# Altium schematic sheet STlink_V3E_PWR.SchDoc: ST-LINK/V3E-SWD Power Module
size A4; Date: Not used; ApprovedBy: Not used; CheckedBy: Not used; Author: Not used; CompanyName: STMicroelectronics; DrawnBy: Not used; Engineer: Not used; Organization: Not used; Address1: Not used; Address2: Not used; Address3: Not used; Address4: Not used; DocumentNumber: Not used; Revision: Not used; SheetNumber: 18; SheetTotal: 19; CurrentTime: Not used; CurrentDate: Not used; Time: Not used; DocumentFullPathAndName: Not used; DocumentName: Not used; ModifiedDate: Not used; ImagePath: Not used; ProjectName: Not used; Application_BuildNumber: Not used
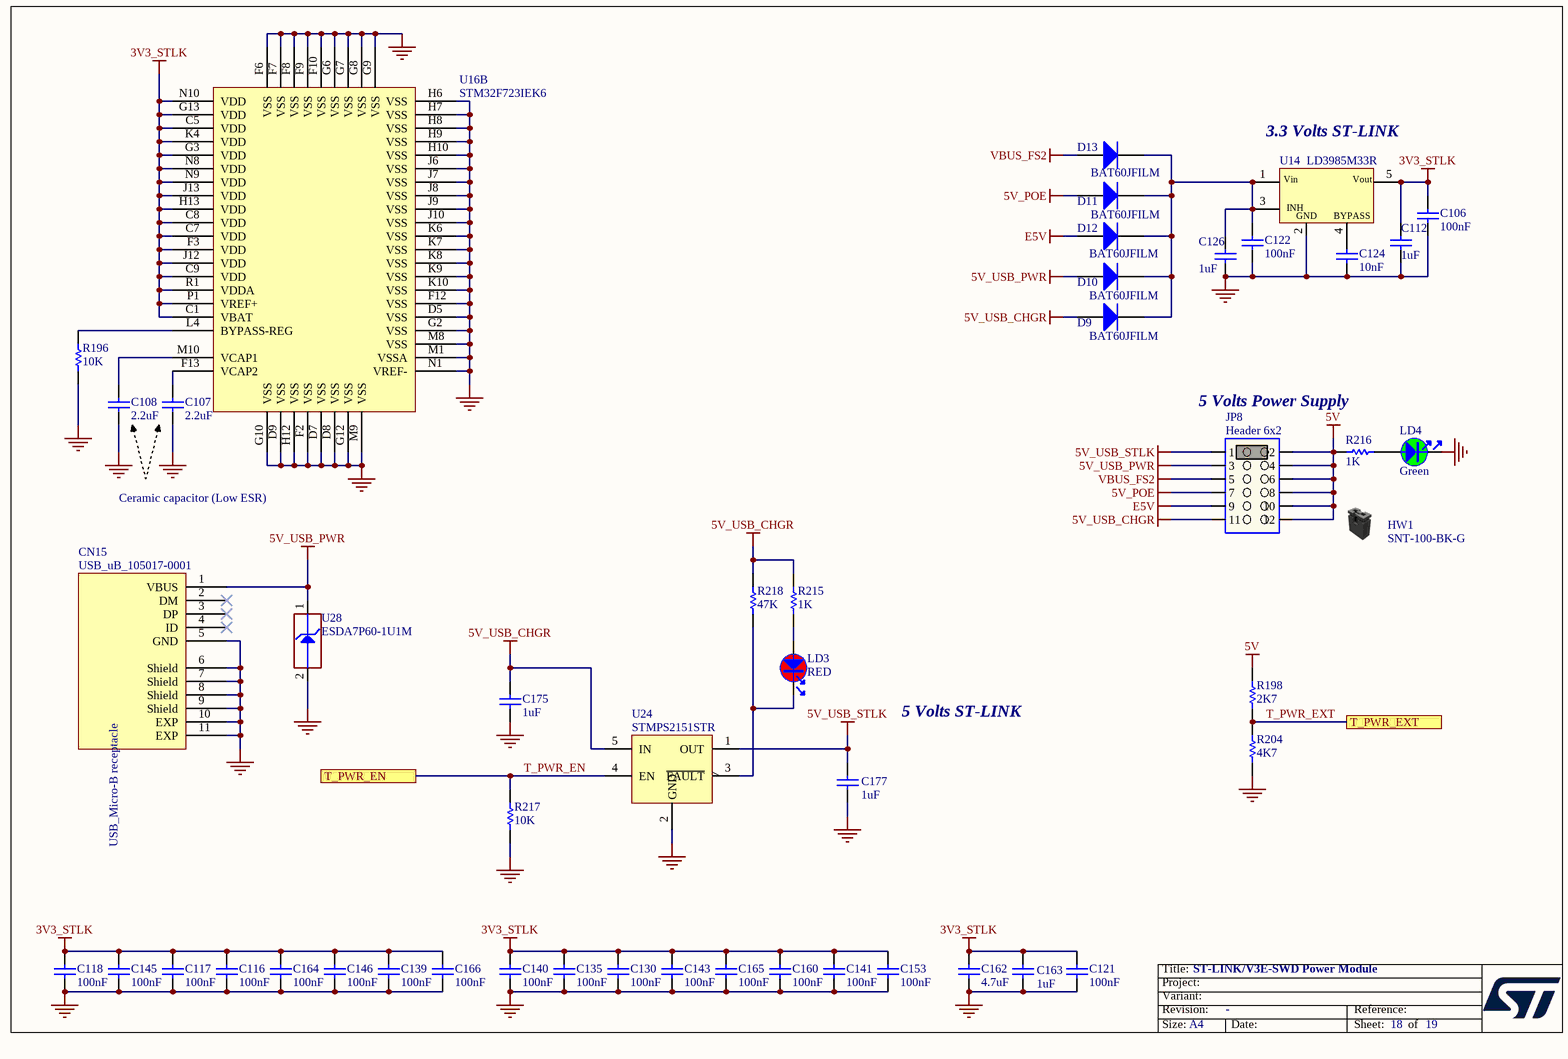
[diagram p0: STlink_V3E_PWR.SchDoc]

## Parts
C106  value 100nF  [C0402]  (hidden comment: Capacitor)
C107  value 2.2uF  [C1206_H1P15]  (hidden comment: Capacitor)
C108  value 2.2uF  [C1206_H1P15]  (hidden comment: Capacitor)
C112  value 1uF  [C0603]  (hidden comment: Capacitor)
C116  value 100nF  [C0402]  (hidden comment: Capacitor)
C117  value 100nF  [C0402]  (hidden comment: Capacitor)
C118  value 100nF  [C0402]  (hidden comment: Capacitor)
C121  value 100nF  [C0402]  (hidden comment: Capacitor)
C122  value 100nF  [C0402]  (hidden comment: Capacitor)
C124  value 10nF  [C0402]  (hidden comment: Capacitor)
C126  value 1uF  [C0603]  (hidden comment: Capacitor)
C130  value 100nF  [C0402]  (hidden comment: Capacitor)
C135  value 100nF  [C0402]  (hidden comment: Capacitor)
C139  value 100nF  [C0402]  (hidden comment: Capacitor)
C140  value 100nF  [C0402]  (hidden comment: Capacitor)
C141  value 100nF  [C0402]  (hidden comment: Capacitor)
C143  value 100nF  [C0402]  (hidden comment: Capacitor)
C145  value 100nF  [C0402]  (hidden comment: Capacitor)
C146  value 100nF  [C0402]  (hidden comment: Capacitor)
C153  value 100nF  [C0402]  (hidden comment: Capacitor)
C160  value 100nF  [C0402]  (hidden comment: Capacitor)
C162  value 4.7uF  [C0603]  (hidden comment: Capacitor)
C163  value 1uF  [C0603]  (hidden comment: Capacitor)
C164  value 100nF  [C0402]  (hidden comment: Capacitor)
C165  value 100nF  [C0402]  (hidden comment: Capacitor)
C166  value 100nF  [C0402]  (hidden comment: Capacitor)
C175  value 1uF  [C0603]  (hidden comment: Capacitor)
C177  value 1uF  [C0603]  (hidden comment: Capacitor)
CN15  value USB_uB_105017-0001  [CON_USBMICROB_MOLEX_105017-0001_H2P90]  (hidden comment: USB_uB_105017.0001)
D9  BAT60JFILM  [DIO_SOD323]
D10  BAT60JFILM  [DIO_SOD323]
D11  BAT60JFILM  [DIO_SOD323]
D12  BAT60JFILM  [DIO_SOD323]
D13  BAT60JFILM  [DIO_SOD323]
HW1  value SNT-100-BK-G  (hidden comment: Shunt Black 2.54mm)  (mechanical)
JP8  value Header 6x2  [CON_SAMTEC_TSW-106-07-X-D]  (hidden comment: Shunt Fitted 1-2)
LD3  value RED  [LED_0603_RED]  (hidden comment: LED_red)
LD4  value Green  [LED_0603_GREEN]  (hidden comment: LED_green)
R196  value 10K  [R0402]  (hidden comment: Resistor)
R198  value 2K7  [R0402]  (hidden comment: Resistor)
R204  value 4K7  [R0402]  (hidden comment: Resistor)
R215  value 1K  [R0402]  (hidden comment: Resistor)
R216  value 1K  [R0603]  (hidden comment: Resistor)
R217  value 10K  [R0402]  (hidden comment: Resistor)
R218  value 47K  [R0402]  (hidden comment: Resistor)
U14  LD3985M33R  [REG_SOT23-5L]
U16  value STM32F723IEK6  [ICC_UFBGA201_176+25_10X10_P065]  (hidden comment: ST-LINKV3E_SWD)  (part B of 2)
U24  STMPS2151STR  [MOS_SOT23-5L]
U28  ESDA7P60-1U1M  [ESD_QFN2_1P6X1_P125]

## Ports
T_PWR_EN, T_PWR_EXT

## Nets
3V3_STLK: C106.2 C112.2 C116.2 C117.2 C118.2 C121.2 C130.2 C135.2 C139.2 C140.2 C141.2 C143.2 C145.2 C146.2 C153.2 C160.2 C162.2 C163.2 C164.2 C165.2 C166.2 U14.5(Vout) U16.C1(VBAT) U16.C5(VDD) U16.C7(VDD) U16.C8(VDD) U16.C9(VDD) U16.F3(VDD) U16.G3(VDD) U16.G13(VDD) U16.H13(VDD) U16.J12(VDD) U16.J13(VDD) U16.K4(VDD) U16.N8(VDD) U16.N9(VDD) U16.N10(VDD) U16.P1(VREF+) U16.R1(VDDA)
5V: JP8.2 JP8.4 JP8.6 JP8.8 JP8.10 JP8.12 R198.2 R216.1
5V_POE: D11.1(A) JP8.7
5V_USB_CHGR: C175.2 D9.1(A) JP8.11 R215.2 R218.2 U24.5(IN)
5V_USB_PWR: CN15.1(VBUS) D10.1(A) JP8.3 U28.1(IO1)
5V_USB_STLK: C177.2 JP8.1 U24.1(OUT)
E5V: D12.1(A) JP8.9
GND: C106.1 C107.1 C108.1 C112.1 C116.1 C117.1 C118.1 C121.1 C122.1 C124.1 C126.2 C130.1 C135.1 C139.1 C140.1 C141.1 C143.1 C145.1 C146.1 C153.1 C160.1 C162.1 C163.1 C164.1 C165.1 C166.1 C175.1 C177.1 CN15.5(GND) CN15.6(Shield) CN15.7(Shield) CN15.8(Shield) CN15.9(Shield) CN15.10(EXP) CN15.11(EXP) LD4.2 R196.1 R204.1 R217.2 U14.2(GND) U16.D5(VSS) U16.D7(VSS) U16.D8(VSS) U16.D9(VSS) U16.F2(VSS) U16.F6(VSS) U16.F7(VSS) U16.F8(VSS) U16.F9(VSS) U16.F10(VSS) U16.F12(VSS) U16.G2(VSS) U16.G6(VSS) U16.G7(VSS) U16.G8(VSS) U16.G9(VSS) U16.G10(VSS) U16.G12(VSS) U16.H6(VSS) U16.H7(VSS) U16.H8(VSS) U16.H9(VSS) U16.H10(VSS) U16.H12(VSS) U16.J6(VSS) U16.J7(VSS) U16.J8(VSS) U16.J9(VSS) U16.J10(VSS) U16.K6(VSS) U16.K7(VSS) U16.K8(VSS) U16.K9(VSS) U16.K10(VSS) U16.M1(VSSA) U16.M8(VSS) U16.M9(VSS) U16.N1(VREF-) U24.2(GND) U28.2(GND)
VBUS_FS2: D13.1(A) JP8.5
T_PWR_EN: R217.1 U24.4(EN) ; port T_PWR_EN
T_PWR_EXT: R198.1 R204.2 ; port T_PWR_EXT
NetC107_2: C107.2 U16.F13(VCAP2)
NetC108_2: C108.2 U16.M10(VCAP1)
NetC122_2: C122.2 C126.1 D9.2(K) D10.2(K) D11.2(K) D12.2(K) D13.2(K) U14.1(Vin) U14.3(CE)
NetC124_2: C124.2 U14.4(BYPASS)
NetLD3_1: LD3.1 R215.1
NetLD3_2: LD3.2 R218.1 U24.3(~{FAULT})
NetLD4_1: LD4.1 R216.2
NetR196_2: R196.2 U16.L4(BYPASS-REG)

Not connected (* = marked no-connect by the designer): CN15 2(DM)* 3(DP)* 4(ID)*

## Notes on the sheet
- (near U14) 3.3 Volts ST-LINK
- 5 Volts Power Supply
- Ceramic capacitor (Low ESR)
- 5 Volts ST-LINK
- Title:
- Project:
- Size:
- Revision:
- Variant:
- A4
- -
- Date:
- Reference:
- Sheet:
- of
- (in symbol MCD-00028) USB_Micro-B receptacle
- (in symbol MCD-00086) INH

## Library data of the parts
C106 C116-C118 C121 C122 C130 C135 C139-C141 C143 C145 C146 C153 C160 C164-C166 = MCD-00006: Capacitor, MLCC, 100nF, 16V, X7R, +/-10%, 0402, T=0.5mm; Manufacturer_Part_Number: CC0402KRX7R7BB104; Manufacturer: YAGEO; Part_Preference: Recommended; Partial_Alternate_Internal_Part_Number: MCD-03299; Component_Country_Of_Origin: China; ID: 2474; Order_Code_RS: 9402047; ShowFields: YES; Internal_Part_Number: MCD-00006; Status: Released; Package: 0402; Part_Type: Capacitor; ComponentLink1URL: http://tunmcdsvn.tun.st.com/Component_Documentation_Library/Trunk/Capacitor/YAGEO_X7R_Series; Order_Code_Digikey: 311-1338-1-ND; Order_Code_Farnell: 9402047
C107 C108 = MCD-00008: Capacitor, MLCC, 2.2uF, 16V, X7R, 10%, 1206, T=1,15mm; Manufacturer_Part_Number: CC1206KKX7R7BB225; Manufacturer: YAGEO; Alternate_Manufacturer_Part_Number: C1206C225K4RAC; Alternate_Manufacturer: KEMET; Part_Preference: Recommended; Provided_By: Subcon; Initial_Board_Reference: MB1274; Component_Country_Of_Origin: China; ID: 2472; ShowFields: YES; Internal_Part_Number: MCD-00008; Status: Released; Part_Type: Capacitor; Package: 1206; ComponentLink1Description: Yageo_Capacitor_X7R-series.pdf; ComponentLink1URL: http://tunmcdsvn.tun.st.com/Component_Documentation_Library/Trunk/Capacitor/YAGEO_X7R_Series; ECCN_US: n/a; ECCN_EU: n/a; Order_Code_Digikey: 311-1957-1-ND; Order_Code_Farnell: N/A; Order_Code_RS: N/A
C112 C163 C175 C177 = MCD-00010: Capacitor, MLCC, 1uF, 16V, X5R, 10%, 0603, T=0,8mm; Manufacturer_Part_Number: CC0603KRX5R7BB105; Manufacturer: YAGEO; Part_Preference: Recommended; Provided_By: Subcon; Initial_Board_Reference: mb1274; Component_Country_Of_Origin: China; ID: 2470; Order_Code_RS: 2370680; ShowFields: YES; Internal_Part_Number: MCD-00010; Status: Released; Package: 0603; ComponentLink1Description: Yageo_Capacitor_X5R-series.pdf; ECCN_US: n/a; ECCN_EU: n/a; Part_Type: Capacitor; ComponentLink1URL: http://tunmcdsvn.tun.st.com/Component_Documentation_Library/Trunk/Capacitor/YAGEO_X5R_Series; Order_Code_Digikey: 311-1444-1-ND; Order_Code_Farnell: 2370680
C124 = MCD-00011: Capacitor, MLCC, 10nF, 16V, X7R, 10%, 0402, T=0.5mm; Manufacturer_Part_Number: CC0402KRX7R7BB103; Manufacturer: YAGEO; Part_Preference: Recommended; Provided_By: Subcon; Initial_Board_Reference: mb1274; Component_Country_Of_Origin: China; ID: 2469; Order_Code_RS: 3019275; ShowFields: YES; Internal_Part_Number: MCD-00011; Status: Released; Part_Type: Capacitor; Package: 0402; ComponentLink1Description: Yageo_Capacitor_X7R-series.pdf; ECCN_US: n/a; ECCN_EU: n/a; ComponentLink1URL: http://tunmcdsvn.tun.st.com/Component_Documentation_Library/Trunk/Capacitor/YAGEO_X7R_Series; Order_Code_Digikey: 311-1042-1-ND; Order_Code_Farnell: 3019275
C126 = MCD-00238: Capacitor, MLCC, 1uF, 6V3, X5R, 10%, 0603, T=0,8mm; Manufacturer_Part_Number: CC0603KRX5R5BB105; Manufacturer: YAGEO; Part_Preference: Recommended; Partial_Alternate_Internal_Part_Number: MCD_00010; Provided_By: Subcon; Initial_Board_Reference: mb1319; Component_Country_Of_Origin: China; ID: 2629; ShowFields: YES; Internal_Part_Number: MCD-00238; Status: Released; Part_Type: Capacitor; Package: 0603; ComponentLink1Description: Yageo_Capacitor_X5R-series.pdf; ECCN_US: n/a; ECCN_EU: n/a; ComponentLink1URL: http://tunmcdsvn.tun.st.com/Component_Documentation_Library/Trunk/Capacitor/YAGEO_X5R_Series; Order_Code_Digikey: 311-1447-1-ND; Order_Code_Farnell: N/A; Order_Code_RS: N/A
C162 = MCD-00009: Capacitor, MLCC, 4.7uF, 16V, X5R, 10%, 0603, T=0.8mm; Manufacturer_Part_Number: CC0603KRX5R7BB475; Manufacturer: YAGEO; Part_Preference: Recommended; Partial_Alternate_Internal_Part_Number: MCD-03565; Provided_By: subcon; Initial_Board_Reference: mb1274; Alternate_EMS: A; Component_Country_Of_Origin: China; ID: 2471; ShowFields: YES; Internal_Part_Number: MCD-00009; Status: Released; Part_Type: Capacitor; Package: 0603; ComponentLink1Description: Yageo_Capacitor_X5R-series.pdf; ECCN_US: n/a; ECCN_EU: n/a; ComponentLink1URL: http://tunmcdsvn.tun.st.com/Component_Documentation_Library/Trunk/Capacitor/YAGEO_X5R_Series; Order_Code_Digikey: 311-1785-1-ND; Order_Code_Farnell: N/A; Order_Code_RS: N/A
CN15 = MCD-00028: USB-MICRO-B, 0.65mm, RA, SMT, Bottom Mount,; Manufacturer_Part_Number: 1050170001; Manufacturer: MOLEX; Part_Type: Connector; Part_Preference: Recommended; Provided_By: Subcon; Initial_Board_Reference: mb1274; Component_Country_Of_Origin: Unknown; ID: 2489; Order_Code_RS: 2293836; ShowFields: YES; Internal_Part_Number: MCD-00028; Status: Released; ComponentLink1Description: Molex_Connector-USB-microB_105017-0001.pdf; ECCN_US: n/a; ECCN_EU: n/a; ComponentLink1URL: http://tunmcdsvn.tun.st.com/Component_Documentation_Library/Trunk/Connector/MOLEX_1050170001; Order_Code_Digikey: WM1399TR-ND; Order_Code_Farnell: 2293836
D9-D13 = MCD-00034: Manufacturer: STMICROELECTRONICS; Part_Type: Diode; BMS_Part_Number: 9151097; Manufacturer_HQ_COO: EU; Part_Preference: Recommended; ECCN_US: EAR99; ECCN_EU: NEC; Provided_By: Subcon; Initial_Board_Reference: mb1274; Component_Country_Of_Origin: China; ID: 2483; Order_Code_RS: 714-6879; ShowFields: YES; Internal_Part_Number: MCD-00034; Value: BAT60JFILM; Status: Released; Manufacturer_Part_Number: BAT60JFILM; ComponentLink1Description: STM_Diode_BAT60JFILM-SOD323.pdf; ComponentLink1URL: http://tunmcdsvn.tun.st.com/Component_Documentation_Library/Trunk/Diode/STMICROELECTRONICS_BAT60J_Series; Order_Code_Digikey: 497-3707-2-ND; Order_Code_Farnell: 1467544; Package: SOD323
HW1 = MCD-00043: Shunt, 2.54mm, Black, 4.3A, 6.1mm, 5mR; Manufacturer: SAMTEC; Part_Type: Misc; Full_Alternate_Internal_Part_Number: MCD-02388; Part_Preference: Recommended; Partial_Alternate_Internal_Part_Number: MCD-01849, MCD-01864; Manufacturer_HQ_COO: Unknown; Component_Country_Of_Origin: China, Costa Rica, Malaysia, USA, Vietnam; ID: 2551; Order_Code_RS: 158-7784; ShowFields: YES; Alternate_EMS: A; Internal_Part_Number: MCD-00043; Status: Released; Manufacturer_Part_Number: SNT-100-BK-G; ComponentLink1URL: http://tunmcdsvn.tun.st.com/Component_Documentation_Library/Trunk/Misc/SAMTEC_SNT-100-BK-G; Order_Code_Digikey: SAM8858-ND; Order_Code_Farnell: 2505007; Package: 2.54x5.08mm
JP8 = MCD-00691: Header, 6x2, 2.54mm, VR, TH, T=5.84mm/2.54mm; Part_Type: Connector; Manufacturer_Part_Number: TSW-106-07-G-D; Manufacturer: SAMTEC; Part_Preference: Recommended; Component_Country_Of_Origin: China, Costa Rica, Malaysia, USA, Vietnam; ID: 3060; Order_Code_RS: 161-2505; ShowFields: YES; Internal_Part_Number: MCD-00691; Status: Released; ComponentLink1URL: http://tunmcdsvn.tun.st.com/Component_Documentation_Library/Trunk/Connector/SAMTEC_TSW_Series/; Order_Code_Digikey: SAM1028-06-ND; Order_Code_Farnell: 2984502
LD3 = MCD-02899: LED, Red, VF : Min=1.75V , Max=2.35V, 25mA, 0603; Part_Type: Display; Part_Preference: Recommended; Manufacturer: EVERLIGHT; Manufacturer_Part_Number: 19-213/R6C-AP1Q2B/5T; Full_Alternate_Internal_Part_Number: MCD-00049; Component_Country_Of_Origin: China; ShowFields: YES; ID: 5015; Internal_Part_Number: MCD-02899; Status: Checked; Package: 0603; ComponentLink1URL: http://tunmcdsvn.tun.st.com/Component_Documentation_Library/Trunk/Display/EVERLIGHT_19-213-R6C-AP1Q2B-5T; Order_Code_Digikey: 1080-19-213/R6C-AP1Q2B/5TTR-ND; Order_Code_Farnell: N/A; Order_Code_RS: N/A
LD4 = MCD-02900: LED, Green, 2V, 20mA, 0603; Part_Type: Display; Part_Preference: Recommended; Manufacturer: EVERLIGHT; Manufacturer_Part_Number: 19-213SYGC/S530-E2/5T; Full_Alternate_Internal_Part_Number: MCD-00320; Partial_Alternate_Internal_Part_Number: MCD-00050; Component_Country_Of_Origin: China; ShowFields: YES; ID: 5016; Internal_Part_Number: MCD-02900; Status: Checked; Package: 0603; ComponentLink1URL: http://tunmcdsvn.tun.st.com/Component_Documentation_Library/Trunk/Display/EVERLIGHT_19-213SYGC-S530-E2-5T; Order_Code_Digikey: 1080-19-213SYGC/S530-E2/5TTR-ND; Order_Code_Farnell: N/A; Order_Code_RS: N/A
R196 = MCD-00053: Resistor,10K,0402,1%,1/16W; Manufacturer_Part_Number: RC0402FR-0710KL; Manufacturer: YAGEO; BMS_Part_Number: 9131590; Part_Preference: Recommended; Provided_By: subcon; Initial_Board_Reference: mb1274; Component_Country_Of_Origin: China; ID: 2539; Order_Code_RS: 9239359; ShowFields: YES; Internal_Part_Number: MCD-00053; Status: Released; ComponentLink1Description: Yageo_Resistor_RC0402-series.pdf; ECCN_US: n/a; ECCN_EU: n/a; Part_Type: Resistor; Package: 0402; ComponentLink1URL: http://tunmcdsvn.tun.st.com/Component_Documentation_Library/Trunk/Resistor/YAGEO_RC_L_Series; Order_Code_Digikey: 311-10.0KLRCT-ND; Order_Code_Farnell: 9239359
R198 = MCD-00055: Resistor,2K7,0402,1%,1/16W; Manufacturer_Part_Number: RC0402FR-072K7L; Manufacturer: YAGEO; Part_Preference: Recommended; Provided_By: Subcon; Initial_Board_Reference: mb1274; Component_Country_Of_Origin: China; ID: 2535; Order_Code_RS: 9239286; ShowFields: YES; Internal_Part_Number: MCD-00055; Status: Released; ComponentLink1Description: Yageo_Resistor_RC0402-series.pdf; ECCN_US: n/a; ECCN_EU: n/a; Part_Type: Resistor; Package: 0402; ComponentLink1URL: http://tunmcdsvn.tun.st.com/Component_Documentation_Library/Trunk/Resistor/YAGEO_RC_L_Series; Order_Code_Digikey: 311-2.70KLRCT-ND; Order_Code_Farnell: 9239286
R204 = MCD-00065: Resistor,4K7,0402,1%,1/16W; Manufacturer_Part_Number: RC0402FR-074K7L; Manufacturer: YAGEO; Alternate_Manufacturer_Part_Number: RT0402FRE074K7L; Part_Preference: Recommended; Partial_Alternate_Internal_Part_Number: MCD-03300; Provided_By: Subcon; Initial_Board_Reference: mb1274; Component_Country_Of_Origin: China; ID: 2526; Order_Code_RS: 9239316; ShowFields: YES; Internal_Part_Number: MCD-00065; Status: Released; ComponentLink1Description: Yageo_Resistor_RC0402-series.pdf; ECCN_US: n/a; ECCN_EU: n/a; Alternate_Manufacturer: YAGEO; Part_Type: Resistor; Package: 0402; ComponentLink1URL: http://tunmcdsvn.tun.st.com/Component_Documentation_Library/Trunk/Resistor/YAGEO_RC_L_Series; Order_Code_Digikey: 311-4.7KLRCT-ND; Order_Code_Farnell: 9239316
R215 = MCD-00061: Resistor,1K,0402,1%,1/16W; Manufacturer_Part_Number: RC0402FR-071KL; Manufacturer: YAGEO; Part_Preference: Recommended; Provided_By: Subcon; Initial_Board_Reference: MB1274; Component_Country_Of_Origin: China; ID: 2532; Order_Code_RS: 9239235; ShowFields: YES; Internal_Part_Number: MCD-00061; Status: Released; ComponentLink1Description: Yageo_Resistor_RC0402-series.pdf; ECCN_US: n/a; ECCN_EU: n/a; Part_Type: Resistor; Package: 0402; ComponentLink1URL: http://tunmcdsvn.tun.st.com/Component_Documentation_Library/Trunk/Resistor/YAGEO_RC_L_Series; Order_Code_Digikey: 311-1.00KLRCT-ND; Order_Code_Farnell: 9239235
R216 = MCD-00070: Resistor,1K,0603,1%,1/10W; Manufacturer_Part_Number: RC0603FR-071KL; Manufacturer: YAGEO; Part_Preference: Recommended; Provided_By: Subcon; Initial_Board_Reference: mb1274; Component_Country_Of_Origin: China; ID: 2522; Order_Code_RS: 9238484RL; ShowFields: YES; Internal_Part_Number: MCD-00070; Status: Released; ComponentLink1Description: Yageo_Resistor_RC0603-series.pdf; ECCN_US: n/a; ECCN_EU: n/a; Part_Type: Resistor; Package: 0603; ComponentLink1URL: http://tunmcdsvn.tun.st.com/Component_Documentation_Library/Trunk/Resistor/YAGEO_RC_L_Series; Order_Code_Digikey: 311-1.00KHRCT-ND; Order_Code_Farnell: 9238484RL
R217 = MCD-00053: Resistor,10K,0402,1%,1/16W; Manufacturer_Part_Number: RC0402FR-0710KL; Manufacturer: YAGEO; BMS_Part_Number: 9131590; Part_Preference: Recommended; Provided_By: subcon; Initial_Board_Reference: MB1274; Component_Country_Of_Origin: China; ID: 2539; Order_Code_RS: 9239359; ShowFields: YES; Internal_Part_Number: MCD-00053; Status: Released; ComponentLink1Description: Yageo_Resistor_RC0402-series.pdf; ECCN_US: n/a; ECCN_EU: n/a; Part_Type: Resistor; Package: 0402; ComponentLink1URL: http://tunmcdsvn.tun.st.com/Component_Documentation_Library/Trunk/Resistor/YAGEO_RC_L_Series; Order_Code_Digikey: 311-10.0KLRCT-ND; Order_Code_Farnell: 9239359
R218 = MCD-00063: Resistor,47K,0402,1%,1/16W; Manufacturer_Part_Number: RC0402FR-0747KL; Manufacturer: YAGEO; Part_Preference: Recommended; Provided_By: Subcon; Initial_Board_Reference: MB1274; Component_Country_Of_Origin: China; ID: 2528; Order_Code_RS: 9239430; ShowFields: YES; Internal_Part_Number: MCD-00063; Status: Released; ComponentLink1Description: Yageo_Resistor_RC0402-series.pdf; ECCN_US: n/a; ECCN_EU: n/a; Part_Type: Resistor; Package: 0402; ComponentLink1URL: http://tunmcdsvn.tun.st.com/Component_Documentation_Library/Trunk/Resistor/YAGEO_RC_L_Series; Order_Code_Digikey: 311-47.0KLRCT-ND; Order_Code_Farnell: 9239430
U14 = MCD-00086: Ultra low drop-low noise BiCMOS voltage, regulators low ESR capacitors compatible; Manufacturer: STMICROELECTRONICS; Part_Type: IC; BMS_Part_Number: 9176161; Manufacturer_HQ_COO: EU; Part_Preference: Recommended; ECCN_US: EAR99; ECCN_EU: NEC; Provided_By: Subcon; Initial_Board_Reference: mb1274; Component_Country_Of_Origin: China; ID: 2506; Order_Code_RS: 168-6500; ShowFields: YES; Internal_Part_Number: MCD-00086; Value: LD3985M33R; Status: Released; Manufacturer_Part_Number: LD3985M33R; ComponentLink1Description: STM_LDO_LD3985.pdf; ComponentLink1URL: http://tunmcdsvn.tun.st.com/Component_Documentation_Library/Trunk/IC/STMICROELECTRONICS_LD3985M33R; Order_Code_Digikey: 497-3504-2-ND; Order_Code_Farnell: 1250121; Package: SOT23-5
U16 = MCD-00596: STM32F723IEK  (STM32F7) BGA176; Part_Type: IC; Manufacturer: STMICROELECTRONICS; BMS_Part_Number: 9175300; Manufacturer_HQ_COO: EU; Part_Preference: Not recommended; Provided_By: SUBCO with ST control; Initial_Board_Reference: MB1331; Item Type: Item; Path: ws/MCD_ApplicationBoards/Lists/MCDPARTSdatabase; Component_Country_Of_Origin: Philippines; ID: 3144; Order_Code_RS: 135-8241; ShowFields: YES; Internal_Part_Number: MCD-00596; Status: Released; Manufacturer_Part_Number: STM32F723IEK6; ComponentLink1Description: Datasheet; ComponentLink1URL: http://tunmcdsvn.tun.st.com/Component_Documentation_Library/Trunk/IC/STMICROELECTRONICS_STM32F723IEK6; Order_Code_Digikey: 497-17186-ND; Order_Code_Farnell: 2725149; Package: UFBGA-201
U24 = MCD-00159: 500mA, Enhanced single channel power switches with active high enable pin; Part_Type: IC; Manufacturer: STMICROELECTRONICS; BMS_Part_Number: 9159009; Part_Preference: Recommended; ECCN_US: EAR99; ECCN_EU: NEC; Provided_By: Subcon; Initial_Board_Reference: MB1264; Component_Country_Of_Origin: Malaysia; ID: 2708; Order_Code_RS: 165-5516; ShowFields: YES; Internal_Part_Number: MCD-00159; Value: STMPS2151STR; Status: Released; Manufacturer_Part_Number: STMPS2151STR; ComponentLink1Description: STM_PWR-Switch_STMPS2151STR.pdf; ComponentLink1URL: http://tunmcdsvn.tun.st.com/Component_Documentation_Library/Trunk/IC/STMICROELECTRONICS_STMPS2151STR; Order_Code_Digikey: 497-6934-2-ND; Order_Code_Farnell: 1842616; Package: SOT23-5
U28 = MCD-00251: High power transient voltage suppressor, 7V breakdown; Part_Type: Diode; Manufacturer: STMICROELECTRONICS; BMS_Part_Number: 9179042; Manufacturer_HQ_COO: EU; Part_Preference: Recommended; ECCN_US: EAR99; ECCN_EU: NEC; Provided_By: Subcon; Initial_Board_Reference: MB1311; Component_Country_Of_Origin: China; ID: 2618; Order_Code_RS: 110-6381; ShowFields: YES; Internal_Part_Number: MCD-00251; Value: ESDA7P60-1U1M; Status: Released; Manufacturer_Part_Number: ESDA7P60-1U1M; ComponentLink1Description: STM_ESD_ESDA7P60-1U1M.pdf; ComponentLink1URL: http://tunmcdsvn.tun.st.com/Component_Documentation_Library/Trunk/Diode/STMICROELECTRONICS_ESDA7P60-1U1M; Order_Code_Digikey: 497-16253-2-ND; Order_Code_Farnell: N/A; Package: QFN1610